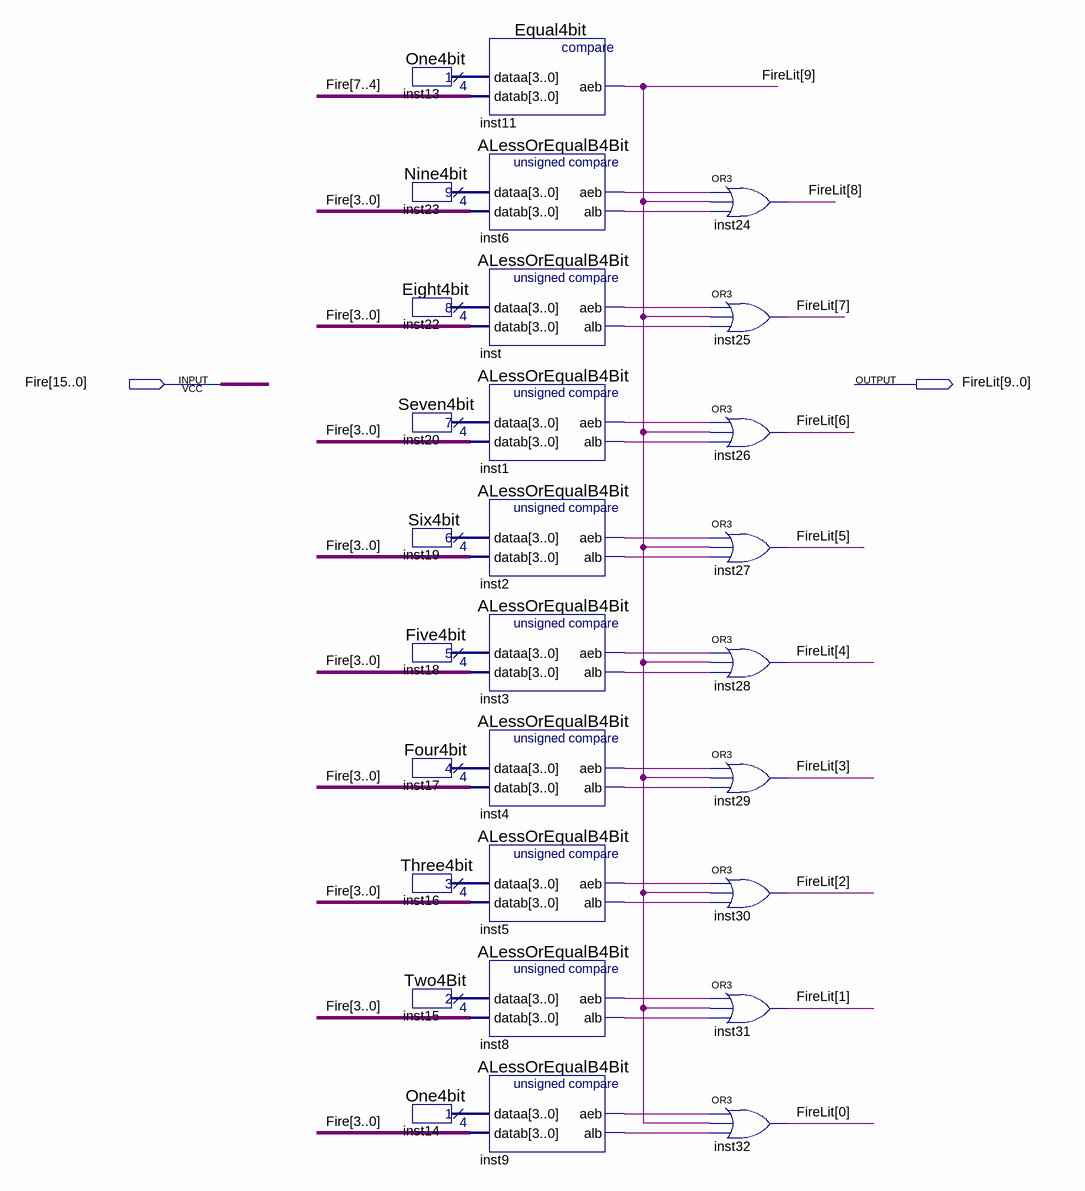
[diagram p0: schematic sheet]
// Quartus schematic FireLitDecoder.bdf as structural Verilog: 29 symbols, 2 pins
module FireLitDecoder (
  input  [15:0] Fire,
  output [9:0] FireLit
);

  wire inst1_aeb, inst1_alb, inst2_aeb, inst2_alb, inst3_aeb, inst3_alb, inst4_aeb, inst4_alb, inst5_aeb,
       inst5_alb, inst6_aeb, inst6_alb, inst8_aeb, inst8_alb, inst9_aeb, inst9_alb, inst_aeb, inst_alb;
  wire [3:0] inst13_result, inst14_result, inst15_result, inst16_result, inst17_result, inst18_result,
       inst19_result, inst20_result, inst22_result, inst23_result;

  One4bit inst13 (.result(inst13_result));
  Nine4bit inst23 (.result(inst23_result));
  Eight4bit inst22 (.result(inst22_result));
  Seven4bit inst20 (.result(inst20_result));
  Six4bit inst19 (.result(inst19_result));
  Five4bit inst18 (.result(inst18_result));
  Four4bit inst17 (.result(inst17_result));
  Three4bit inst16 (.result(inst16_result));
  Two4Bit inst15 (.result(inst15_result));
  One4bit inst14 (.result(inst14_result));
  Equal4bit inst11 (.dataa(inst13_result), .datab(Fire[7:4]), .aeb(FireLit[9]));
  ALessOrEqualB4Bit inst6 (.dataa(inst23_result), .datab(Fire[3:0]), .aeb(inst6_aeb), .alb(inst6_alb));
  ALessOrEqualB4Bit inst (.dataa(inst22_result), .datab(Fire[3:0]), .aeb(inst_aeb), .alb(inst_alb));
  ALessOrEqualB4Bit inst1 (.dataa(inst20_result), .datab(Fire[3:0]), .aeb(inst1_aeb), .alb(inst1_alb));
  ALessOrEqualB4Bit inst2 (.dataa(inst19_result), .datab(Fire[3:0]), .aeb(inst2_aeb), .alb(inst2_alb));
  ALessOrEqualB4Bit inst3 (.dataa(inst18_result), .datab(Fire[3:0]), .aeb(inst3_aeb), .alb(inst3_alb));
  ALessOrEqualB4Bit inst4 (.dataa(inst17_result), .datab(Fire[3:0]), .aeb(inst4_aeb), .alb(inst4_alb));
  ALessOrEqualB4Bit inst5 (.dataa(inst16_result), .datab(Fire[3:0]), .aeb(inst5_aeb), .alb(inst5_alb));
  ALessOrEqualB4Bit inst8 (.dataa(inst15_result), .datab(Fire[3:0]), .aeb(inst8_aeb), .alb(inst8_alb));
  ALessOrEqualB4Bit inst9 (.dataa(inst14_result), .datab(Fire[3:0]), .aeb(inst9_aeb), .alb(inst9_alb));
  or inst24 (FireLit[8], inst6_aeb, FireLit[9], inst6_alb);
  or inst25 (FireLit[7], inst_aeb, FireLit[9], inst_alb);
  or inst26 (FireLit[6], inst1_aeb, FireLit[9], inst1_alb);
  or inst27 (FireLit[5], inst2_aeb, FireLit[9], inst2_alb);
  or inst28 (FireLit[4], inst3_aeb, FireLit[9], inst3_alb);
  or inst29 (FireLit[3], inst4_aeb, FireLit[9], inst4_alb);
  or inst30 (FireLit[2], inst5_aeb, FireLit[9], inst5_alb);
  or inst31 (FireLit[1], inst8_aeb, FireLit[9], inst8_alb);
  or inst32 (FireLit[0], inst9_aeb, FireLit[9], inst9_alb);
endmodule
